# Altium schematic sheet Inverter_Power.SchDoc
size A4; SheetNumber: 1; SheetTotal: 5
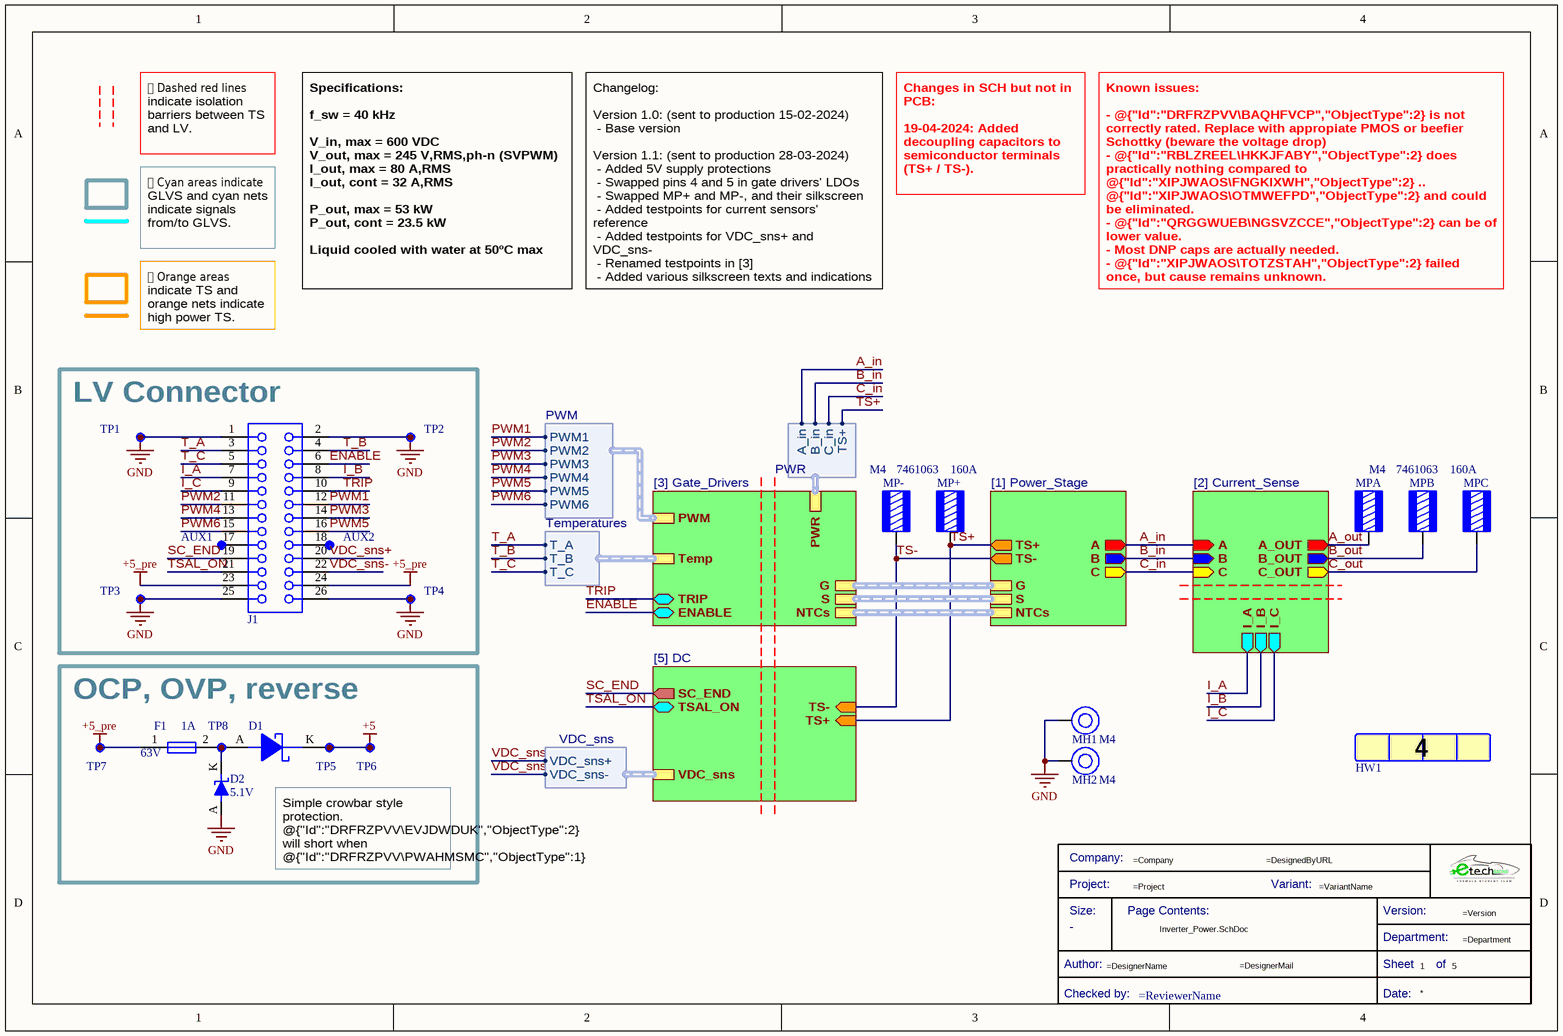
[diagram p0: Inverter_Power.SchDoc]

## Parts
*  Title Block_template  (value not drawn)  (graphical)
AUX1  TestPoint  [TestPoint]  (value not drawn)  (no BOM)
AUX2  TestPoint  [TestPoint]  (value not drawn)  (no BOM)
D1  MBR0530  [DSC-SOD123]  (value not drawn)
D2  Reference Voltage-Nom: 5.1V  [DZ-6.2V-DO-214AC]  (hidden comment: BZG05C5V1-E3-TR)
F1  Current Rating: 1A  Voltage Rating (DC): 63V  [Fuse_1206]  (hidden comment: 0437001.WRA)
HW1  LOGO CAPAS (4)  [LOGO_LAYERS_4]  (value not drawn)
J1  613026243121  [613026243121]  (value not drawn)
MH1  Mounting_Hole_M4  [Mounting_Hole_M4]  (value not drawn)
MH2  Mounting_Hole_M4  [Mounting_Hole_M4]  (value not drawn)
MP+  M4  [7461063_HAL]  (value not drawn)
MP-  Rated Current: 160A  [7461063_HAL]  (hidden comment: M4)
MPA  M4  [7461063_HAL]  (value not drawn)
MPB  Rated Current: 160A  [7461063_HAL]  (hidden comment: M4)
MPC  M4  [7461063_HAL]  (value not drawn)
TP1  TestPoint  [TestPoint]  (value not drawn)  (no BOM)
TP2  TestPoint  [TestPoint]  (value not drawn)  (no BOM)
TP3  TestPoint  [TestPoint]  (value not drawn)  (no BOM)
TP4  TestPoint  [TestPoint]  (value not drawn)  (no BOM)
TP5  TestPoint  [TestPoint]  (value not drawn)  (no BOM)
TP6  TestPoint  [TestPoint]  (value not drawn)  (no BOM)
TP7  TestPoint  [TestPoint]  (value not drawn)  (no BOM)
TP8  TestPoint  [TestPoint]  (value not drawn)  (no BOM)

## Blocks framed on the sheet
LV Connector: AUX1 AUX2 J1 TP1-TP4
OCP, OVP, reverse: D1 D2 F1 TP5-TP8

## Sub-sheets
Current_Sense = [2] Current_Sense: A (in), B (in), C (in), A_OUT (out), B_OUT (out), C_OUT (out), I_B (out), I_A (out), I_C (out)
DC = [5] DC: TS+ (in), TS- (in), VDC_sns (harness VDC_sns), TSAL_ON (bidir), SC_END (out)
Gate_Drivers = [3] Gate_Drivers: ENABLE (bidir), S (harness S), G (harness G), PWM (harness PWM), NTCs (harness NTCs), Temp (harness Temperatures), TRIP (bidir), PWR (harness PWR)
Power_Stage = [1] Power_Stage: A (out), B (out), C (out), TS+ (out), TS- (out), NTCs (harness NTCs), S (harness S), G (harness G)

## Harnesses
PWM: PWM1, PWM2, PWM3, PWM4, PWM5, PWM6
Temperatures: T_A, T_B, T_C
PWR: A_in, B_in, C_in, TS+
VDC_sns: VDC_sns+, VDC_sns-

## Nets
+5: D1.K TP5.1(TP) TP6.1(TP)
+5_pre: F1.1 J1.23 J1.24 TP7.1(TP)
GND: D2.A J1.1 J1.2 J1.25 J1.26 MH1.1 MH2.1 TP1.1(TP) TP2.1(TP) TP3.1(TP) TP4.1(TP)
A_in: sheet Power_Stage/A, sheet Current_Sense/A, sheet Gate_Drivers/PWR.A_in
A_out: MPA.1 ; sheet Current_Sense/A_OUT
B_in: sheet Power_Stage/B, sheet Current_Sense/B, sheet Gate_Drivers/PWR.B_in
B_out: MPB.1 ; sheet Current_Sense/B_OUT
C_in: sheet Power_Stage/C, sheet Current_Sense/C, sheet Gate_Drivers/PWR.C_in
C_out: MPC.1 ; sheet Current_Sense/C_OUT
ENABLE: J1.6 ; sheet Gate_Drivers/ENABLE
I_A: J1.7 ; sheet Current_Sense/I_A
I_B: J1.8 ; sheet Current_Sense/I_B
I_C: J1.9 ; sheet Current_Sense/I_C
PWM1: J1.12 ; sheet Gate_Drivers/PWM.PWM1
PWM2: J1.11 ; sheet Gate_Drivers/PWM.PWM2
PWM3: J1.14 ; sheet Gate_Drivers/PWM.PWM3
PWM4: J1.13 ; sheet Gate_Drivers/PWM.PWM4
PWM5: J1.16 ; sheet Gate_Drivers/PWM.PWM5
PWM6: J1.15 ; sheet Gate_Drivers/PWM.PWM6
SC_END: J1.19 ; sheet DC/SC_END
T_A: J1.3 ; sheet Gate_Drivers/Temp.T_A
T_B: J1.4 ; sheet Gate_Drivers/Temp.T_B
T_C: J1.5 ; sheet Gate_Drivers/Temp.T_C
TRIP: J1.10 ; sheet Gate_Drivers/TRIP
TS+: MP+.1 ; sheet Power_Stage/TS+, sheet DC/TS+, sheet Gate_Drivers/PWR.TS+
TS-: MP-.1 ; sheet Power_Stage/TS-, sheet DC/TS-
TSAL_ON: J1.21 ; sheet DC/TSAL_ON
VDC_sns+: J1.20 ; sheet DC/VDC_sns.VDC_sns+
VDC_sns-: J1.22 ; sheet DC/VDC_sns.VDC_sns-
NetAUX1_1: AUX1.1(TP) J1.17
NetAUX2_1: AUX2.1(TP) J1.18
NetD1_A: D1.A D2.K F1.2 TP8.1(TP)

## Buses and harness runs
harness sheet Gate_Drivers/G = sheet Power_Stage/G
harness sheet Gate_Drivers/NTCs = sheet Power_Stage/NTCs
harness sheet Gate_Drivers/S = sheet Power_Stage/S

## Notes on the sheet
- ⓘ Dashed red lines indicate isolation barriers between TS and LV.
- ⓘ Cyan areas indicate GLVS and cyan nets indicate signals from/to GLVS.
- Changes in SCH but not in PCB:
  19-04-2024: Added decoupling capacitors to semiconductor terminals (TS+ / TS-).
- Specifications:
  f_sw = 40 kHz
  V_in, max = 600 VDC
  V_out, max = 245 V,RMS,ph-n (SVPWM)
  I_out, max = 80 A,RMS
  I_out, cont = 32 A,RMS
  P_out, max = 53 kW
  P_out, cont = 23.5 kW
  Liquid cooled with water at 50ºC max
- Changelog:
  Version 1.0: (sent to production 15-02-2024)
  - Base version
  Version 1.1: (sent to production 28-03-2024)
  - Added 5V supply protections
  - Swapped pins 4 and 5 in gate drivers' LDOs
  - Swapped MP+ and MP-, and their silkscreen
  - Added testpoints for current sensors' reference
  - Added testpoints for VDC_sns+ and VDC_sns-
  - Renamed testpoints in [3]
  - Added various silkscreen texts and indications
  - Added layer physical logo
- Known issues:
  - @{"Id":"DRFRZPVV\BAQHFVCP","ObjectType":2} is not correctly rated. Replace with appropiate PMOS or beefier Schottky (beware the voltage drop)
  - @{"Id":"RBLZREEL\HKKJFABY","ObjectType":2} does practically nothing compared to @{"Id":"XIPJWAOS\FNGKIXWH","ObjectType":2} .. @{"Id":"XIPJWAOS\OTMWEFPD","ObjectType":2} and could be eliminated.
  - @{"Id":"QRGGWUEB\NGSVZCCE","ObjectType":2} can be of lower value.
  - Most DNP caps are actually needed.
  - @{"Id":"XIPJWAOS\TOTZSTAH","ObjectType":2} failed once, but cause remains unknown.
  - @{"Id":"XIPJWAOS\BERXNCAD","ObjectType":2} should have a bigger value.
  - @{"Id":"XIPJWAOS\TLMWNZGJ","ObjectType":2} and @{"Id":"XIPJWAOS\ETFZDMYQ","ObjectType":2} should have a small tolerance, and it should be specified in the schematic.
  - 10uF 50V 0805 caps are expensive and should be replaced with 10uF 50V 1206 or 10uF 50V 1210.
- ⓘ Orange areas indicate TS and orange nets indicate high power TS.
- M4
- (near MH2) M4
- Simple crowbar style protection. @{"Id":"DRFRZPVV\EVJDWDUK","ObjectType":2} will short when @{"Id":"DRFRZPVV\PWAHMSMC","ObjectType":1} > 5.1V, and it will cause the fuse to blow.
- (in symbol LOGO CAPAS) 4 Layers
- (in symbol Title Block_template) Company:; Project:; Variant:; Size:; Page Contents:; Version:; Department:; Author:; Sheet; of; Checked by:; Date:

## Library data of the parts
* = Title Block_template: Standard Title Block; .Creator: GP; Category: Title Block; .PCBcheck: GP; .SCHcheck: GP; Checked by:: =ReviewerName; Size: -
AUX1 AUX2 TP1-TP8 = TestPoint: Test Point 1x1 mm; .Creator: GP; Category: TestPoint; .PCBcheck: GP; .SCHcheck: GP
D1 = DSC-0.5/30-SOD123: VR=30V IF=500mA 30pF P=410mW; Element Configuration: Single; Forward Voltage: 430mV; Peak Non-Repetitive Surge Current: 5.5A; Average Rectified Current: 500mA; Max Reverse Leakage Current: 130uA; Max Reverse Voltage (DC): 30V; Polarity: Standard; .Creator: GP; Category: Diode; ComponentLink1Description: Datasheet; ComponentLink1URL: *; ComponentLink2Description: Where buy it; ComponentLink2URL: *; Supplier 1: Newark; Stock 1: 9; Pricing 1: 1=0,34400, 10=0,23900, 100=0,12200, 500=0,10000 (USD); Mount: Surface Mount; Contact Plating: Tin,Matte; Weight: 0.03g; Package Quantity: 1; Max Surge Current: 5.5A; Forward Current: 500mA; Max Reverse Current: 130uA; Max Repetitive Reverse Voltage (Vrrm): 30V; Max Forward Surge Current (Ifsm): 5.5A; Voltage Rating (DC): 30V; Current Rating: 500mA; Output Current: 500mA; Series: -; Length: 2.7mm; Width: 1.6mm; Height: 1.03mm; Radiation Hardening: No; RoHS Compliant: Yes; REACH SVHC: No SVHC; Lead Free: Lead Free; ComponentLink3URL: https://datasheet.ciiva.com/30479/0900766b810e2512-30479401.pdf?src-supplier=RSComponents; ComponentLink3Description: https://datasheet.ciiva.com/30479/0900766b810e2512-30479401.pdf?src-supplier=RSComponents; ComponentLink4URL: https://datasheet.ciiva.com/34301/974753-34301826.pdf?src-supplier=Jameco; ComponentLink4Description: https://datasheet.ciiva.com/34301/974753-34301826.pdf?src-supplier=Jameco; ComponentLink5URL: https://datasheet.ciiva.com/910/mbr0530-910516.pdf?src-supplier=Digi-Key; ComponentLink5Description: https://datasheet.ciiva.com/910/mbr0530-910516.pdf?src-supplier=Digi-Key; ComponentLink6URL: https://datasheet.ciiva.com/25931/mbr0530-25931989.pdf?src-supplier=Avnet+Europe; ComponentLink6Description: https://datasheet.ciiva.com/25931/mbr0530-25931989.pdf?src-supplier=Avnet+Europe; ComponentLink7URL: https://datasheet.ciiva.com/8300/mbr0530-8300905.pdf?src-supplier=Avnet; ComponentLink7Description: https://datasheet.ciiva.com/8300/mbr0530-8300905.pdf?src-supplier=Avnet; ComponentLink8URL: https://datasheet.ciiva.com/17318/mbr0530-17318568.pdf?src-supplier=Future+Electronics; ComponentLink8Description: https://datasheet.ciiva.com/17318/mbr0530-17318568.pdf?src-supplier=Future+Electronics; ComponentLink9URL: https://datasheet.ciiva.com/15144/getdatasheetpartid-86760-15144598.pdf?src-supplier=Verical; ComponentLink9Description: https://datasheet.ciiva.com/15144/getdatasheetpartid-86760-15144598.pdf?src-supplier=Verical; ComponentLink10URL: https://datasheet.ciiva.com/910/mbr0530-910518.pdf?src-supplier=Digi-Key; ComponentLink10Description: https://datasheet.ciiva.com/910/mbr0530-910518.pdf?src-supplier=Digi-Key; Supplier Part Number 1: 15R3453
D2 = DZ-5.1V-DO-214AC: Zener Diode, 5.1V V(Z), 5.88%, 1.25W, Silicon, Unidirectional, DO-214AC; Manufacturer: Vishay; Manufacturer Part Number: BZG05C5V1-M3-08; Package Body Material: Plastic; Additional Feature: HIGH RELIABILITY; Number of Elements: 1; Test Current: 45mA; Time @ Peak Reflow Temperature-Max (s): 30s; Supplier: Mouser; Supplier Part Number: 78-BZG05C5V1-M3-08; RoHS: Yes; Category: Zener Diodes; Stock: 28077; Pricing: 1=0,38, 10=0,3, 50=0,3, 100=0,179, 1000=0,113, 10000=0,089 (USD); Pins: 2; Diode Element Material: SILICON; Package Shape: Rectangular; Terminal Finish: Tin; Max Operating Temperature: 150°C; JESD-609 Code: e3; Polarity: Unidirectional; Diode Type: ZENER; JESD-30 Code: R-PDSO-C2; Moisture Sensitivity Level: 1; Package Style: SMALL OUTLINEMeter; Peak Reflow Temperature (Cel): 260°C; Max Power Dissipation: 1.25W; Surface Mount: Yes; Technology: ZENER; Terminal Form: C BEND; Terminal Position: DUAL; Voltage Tol-Max: 5.88%; JEDEC-95 Code: DO-214AC; RoHS Compliant: Yes; Reach SVHC Compliant: No; ComponentLink1URL: https://datasheet.ciiva.com:443/pdfs/VipMasterIC/IC/VISH/VISH-S-A0008998108/VISH-S-A0008998108-1.pdf?src-supplier=IHS+Markit; ComponentLink1Description: https://datasheet.ciiva.com:443/pdfs/VipMasterIC/IC/VISH/VISH-S-A0008998108/VISH-S-A0008998108-1.pdf?src-supplier=IHS+Markit; ComponentLink2URL: http://www.vishay.com/docs/86135/bzg05c-m-series.pdf?src-supplier=Digikey; ComponentLink2Description: http://www.vishay.com/docs/86135/bzg05c-m-series.pdf?src-supplier=Digikey
F1 = Fuse_1A_63V_1206: Fuse Chip Fast Acting 1A 63V SMD Solder Pad 1206 Ceramic T/R Automotive; Manufacturer: Littelfuse; Fuse Type: Board Mount (Cartridge Style Excluded); Approvals: CSA,cURus; .Creator: DO; Supplier 1: Digi-Key; Manufacturer Part Number: 0437001.WRA; RoHS: Yes; Category: Fuses; Stock 1: 5820; Pricing 1: 1=1,52000, 5=1,47000, 10=1,37600, 50=1,13860, 100=0,94880, 250=0,92508, 500=0,78276, 1000=0,68788 (USD); Mount: Surface Mount; Case/Package: 1206; Case Code (Imperial): 1206; Case Code (Metric): 3216; Min Operating Temperature: -55°C; Max Operating Temperature: 150°C; Packaging: Tape and Reel; Voltage Rating (AC): 63V; ComponentLink1URL: https://www.littelfuse.com/~/media/electronics/datasheets/fuses/littelfuse_fuse_437a_datasheet.pdf.pdf?src-supplier=Digi-Key; ComponentLink1Description: https://www.littelfuse.com/~/media/electronics/datasheets/fuses/littelfuse_fuse_437a_datasheet.pdf.pdf?src-supplier=Digi-Key; Supplier Part Number 1: F10001CT-ND; ComponentLink2Description: Where buy it; ComponentLink2URL: https://www.mouser.es/ProductDetail/Littelfuse/0437001WRA?qs=DXv0QSHKF4z9CJhPXjxR%252BA%3D%3D
HW1 = LOGO CAPAS: Logo 4 capas; Id: 0074; Observations: Layers; Checked: False; Type: Logos; Supplier 1: Farnell; Supplier 2: Mouser; Supplier 3: RS; Supplier 4: Digi-Key; Author: Enric; Date: 22/06/2012
J1 = 613026243121: WR-PHD Socket Header, THT, Angled, pitch 2.54mm, 2 Row, 26P; Manufacturer: Wurth Elektronik; Contact Resistance: 20mΩ; Rated Current: 3A; Working Voltage: 250V; Withstanding Voltage: 500V; ComponentLink1Description: Website Link; ComponentLink1URL: https://www.we-online.com/redexpert/article/613026243121?ad; ComponentLink2Description: Datasheet Link; ComponentLink2URL: https://www.we-online.com/redexpert/spec/613026243121?ad; Manufacturer Part Number: 613026243121; Category: Board-to-Board Connectors; Match Code: WR-PHD; Mount: Through Hole; Operating Temperature Max: 125°C; Operating Temperature Min: -40°C; Packaging: Tray; Gender: Socket Header; Number of Pins: 26; Number of Rows: 2; Orientation: Angled; Pitch: 2.54mm
MP+ MP- MPA MPB MPC = 7461063: WP-RATR REDCUBE PRESS-FIT right angled, two-rows, L9W9H14mm, M4, 160A; Manufacturer: Wurth Elektronik; Surface: Tin; ComponentLink1Description: Website Link; ComponentLink1URL: https://www.we-online.com/redexpert/article/7461063?ad; ComponentLink2Description: Datasheet Link; ComponentLink2URL: https://www.we-online.com/redexpert/spec/7461063?ad; Manufacturer Part Number: 7461063; Category: REDCUBE PRESS-FIT; Match Code: WP-RATR; Mount: Press Fit; Operating Temperature Max: 150°C; Operating Temperature Min: -55°C; Packaging: Bulk; Length: 9mm; Width: 9mm; Height: 14mm; Material: Brass; Number of Pins: 8; Thread Size: M4
  MP+ MPA MPC: Rated Current: 160A